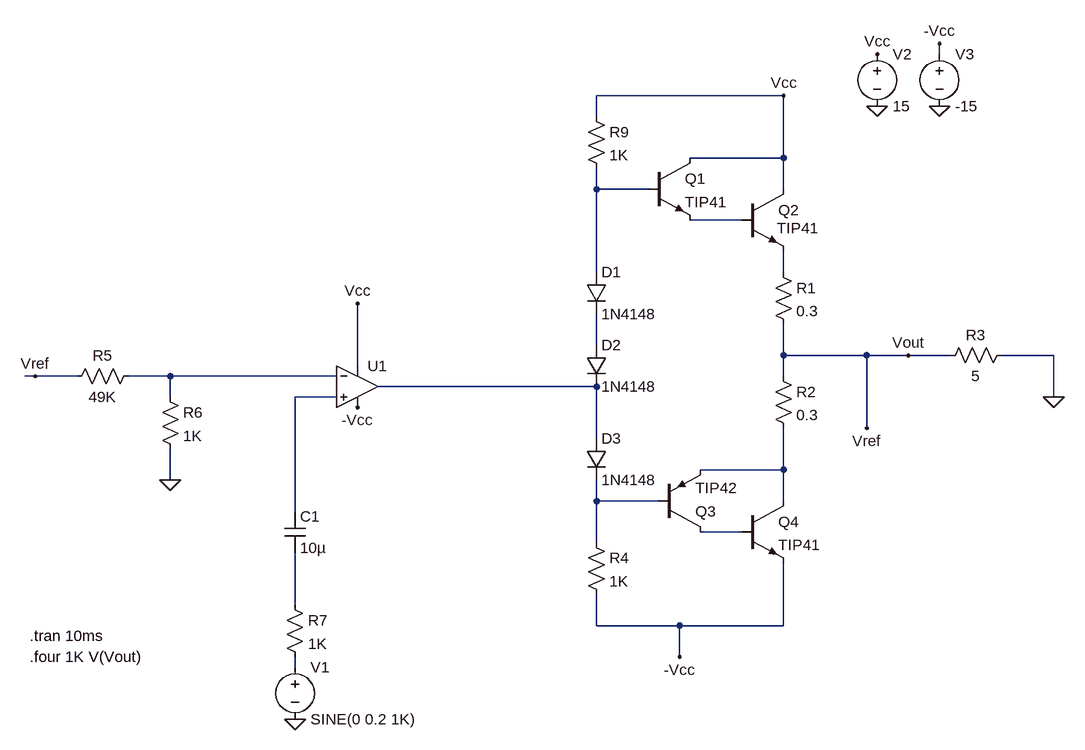
[diagram p0: schematic AB_Amplifier_upgraded.asc]
AB_Amplifier_upgraded.asc, the LTspice schematic file:
Version 4
SHEET 1 880 960
WIRE 528 -112 528 -128
WIRE 288 -48 0 -48
WIRE 0 -16 0 -48
WIRE 288 48 288 -48
WIRE 288 48 144 48
WIRE 0 96 0 64
WIRE 80 96 0 96
WIRE 288 96 288 48
WIRE 224 144 144 144
WIRE 0 224 0 96
WIRE 288 224 288 192
WIRE 0 336 0 288
WIRE 288 352 288 304
WIRE 416 352 288 352
WIRE 480 352 416 352
WIRE 544 352 480 352
WIRE 704 352 624 352
WIRE -368 368 -368 272
WIRE -864 384 -880 384
WIRE -800 384 -864 384
WIRE -656 384 -720 384
WIRE -400 384 -656 384
WIRE 288 384 288 352
WIRE 0 400 -336 400
WIRE -656 416 -656 384
WIRE -400 416 -464 416
WIRE 704 416 704 352
WIRE 416 464 416 352
WIRE 0 480 0 400
WIRE 288 528 288 464
WIRE 288 528 160 528
WIRE -656 544 -656 496
WIRE 0 576 0 544
WIRE 96 576 0 576
WIRE 288 576 288 528
WIRE -464 592 -464 416
WIRE 224 624 160 624
WIRE 0 640 0 576
WIRE -464 736 -464 656
WIRE 0 768 0 720
WIRE 128 768 0 768
WIRE 288 768 288 672
WIRE 288 768 128 768
WIRE 128 816 128 768
WIRE -464 832 -464 816
FLAG 704 416 0
FLAG -464 912 0
FLAG 288 -48 Vcc
FLAG 432 -32 0
FLAG 432 -112 Vcc
FLAG 416 464 Vref
FLAG -656 544 0
FLAG 528 -32 0
FLAG -368 272 Vcc
FLAG 480 352 Vout
FLAG 528 -128 -Vcc
FLAG -368 432 -Vcc
FLAG 128 816 -Vcc
FLAG -864 384 Vref
SYMBOL npn 80 48 R0
SYMATTR InstName Q1
SYMATTR Value TIP41
SYMBOL npn 224 96 R0
WINDOW 3 54 60 Left 2
SYMATTR InstName Q2
SYMATTR Value TIP41
SYMBOL res 272 208 R0
SYMATTR InstName R1
SYMATTR Value 0.3
SYMBOL res 272 368 R0
SYMATTR InstName R2
SYMATTR Value 0.3
SYMBOL res 640 336 R90
WINDOW 0 0 56 VBottom 2
WINDOW 3 32 56 VTop 2
SYMATTR InstName R3
SYMATTR Value 5
SYMBOL pnp 96 624 M180
SYMATTR InstName Q3
SYMATTR Value TIP42
SYMBOL npn 224 576 R0
SYMATTR InstName Q4
SYMATTR Value TIP41
SYMBOL diode -16 224 R0
SYMATTR InstName D1
SYMATTR Value 1N4148
SYMBOL diode -16 336 R0
SYMATTR InstName D2
SYMATTR Value 1N4148
SYMBOL diode -16 480 R0
SYMATTR InstName D3
SYMATTR Value 1N4148
SYMBOL res -16 624 R0
SYMATTR InstName R4
SYMATTR Value 1K
SYMBOL voltage -464 816 R0
WINDOW 123 0 0 Left 0
WINDOW 39 0 0 Left 0
SYMATTR InstName V1
SYMATTR Value SINE(0 0.2 1K)
SYMBOL voltage 432 -128 R0
WINDOW 123 0 0 Left 0
WINDOW 39 0 0 Left 0
SYMATTR InstName V2
SYMATTR Value 15
SYMBOL res -16 -32 R0
SYMATTR InstName R9
SYMATTR Value 1K
SYMBOL res -704 368 R90
WINDOW 0 0 56 VBottom 2
WINDOW 3 32 56 VTop 2
SYMATTR InstName R5
SYMATTR Value 49K
SYMBOL res -672 400 R0
SYMATTR InstName R6
SYMATTR Value 1K
SYMBOL voltage 528 -128 R0
WINDOW 123 0 0 Left 0
WINDOW 39 0 0 Left 0
SYMATTR InstName V3
SYMATTR Value -15
SYMBOL res -480 720 R0
SYMATTR InstName R7
SYMATTR Value 1K
SYMBOL OpAmps\\UniversalOpAmp2 -368 400 R0
SYMATTR InstName U1
SYMBOL cap -480 592 R0
SYMATTR InstName C1
SYMATTR Value 10µ
TEXT -872 784 Left 2 !.tran 10ms
TEXT -872 816 Left 2 !.four 1K V(Vout)

The netlist it stands for:
* AB_Amplifier_upgraded.asc
Q1 Vcc N001 N002 0 TIP41
Q2 Vcc N002 N003 0 TIP41
R1 N003 Vout 0.3
R2 Vout N008 0.3
R3 0 Vout 5
Q3 N010 N009 N008 0 TIP42
Q4 N008 N010 -Vcc 0 TIP41
D1 N001 N004 1N4148
D2 N004 N006 1N4148
D3 N006 N009 1N4148
R4 N009 -Vcc 1K
V1 N012 0 SINE(0 0.2 1K)
V2 Vcc 0 15
R9 Vcc N001 1K
R5 N005 Vout 49K
R6 N005 0 1K
V3 -Vcc 0 -15
R7 N011 N012 1K
XU1 N007 N005 Vcc -Vcc N006 level2 Avol=1Meg GBW=10Meg Slew=10Meg Ilimit=25m Rail=0 Vos=0 En=0 Enk=0 In=0 Ink=0 Rin=500Meg  ; pins In+ In- V+ V- OUT
C1 N007 N011 10µ
.model D D
.lib standard.dio
.model NPN NPN
.model PNP PNP
.lib standard.bjt
.tran 10ms
.four 1K V(Vout)
.lib UniversalOpAmp2.lib
.backanno
.end